# EAGLE schematic schematic (EAGLE 8.4.1)

## Sheet 1 of 2
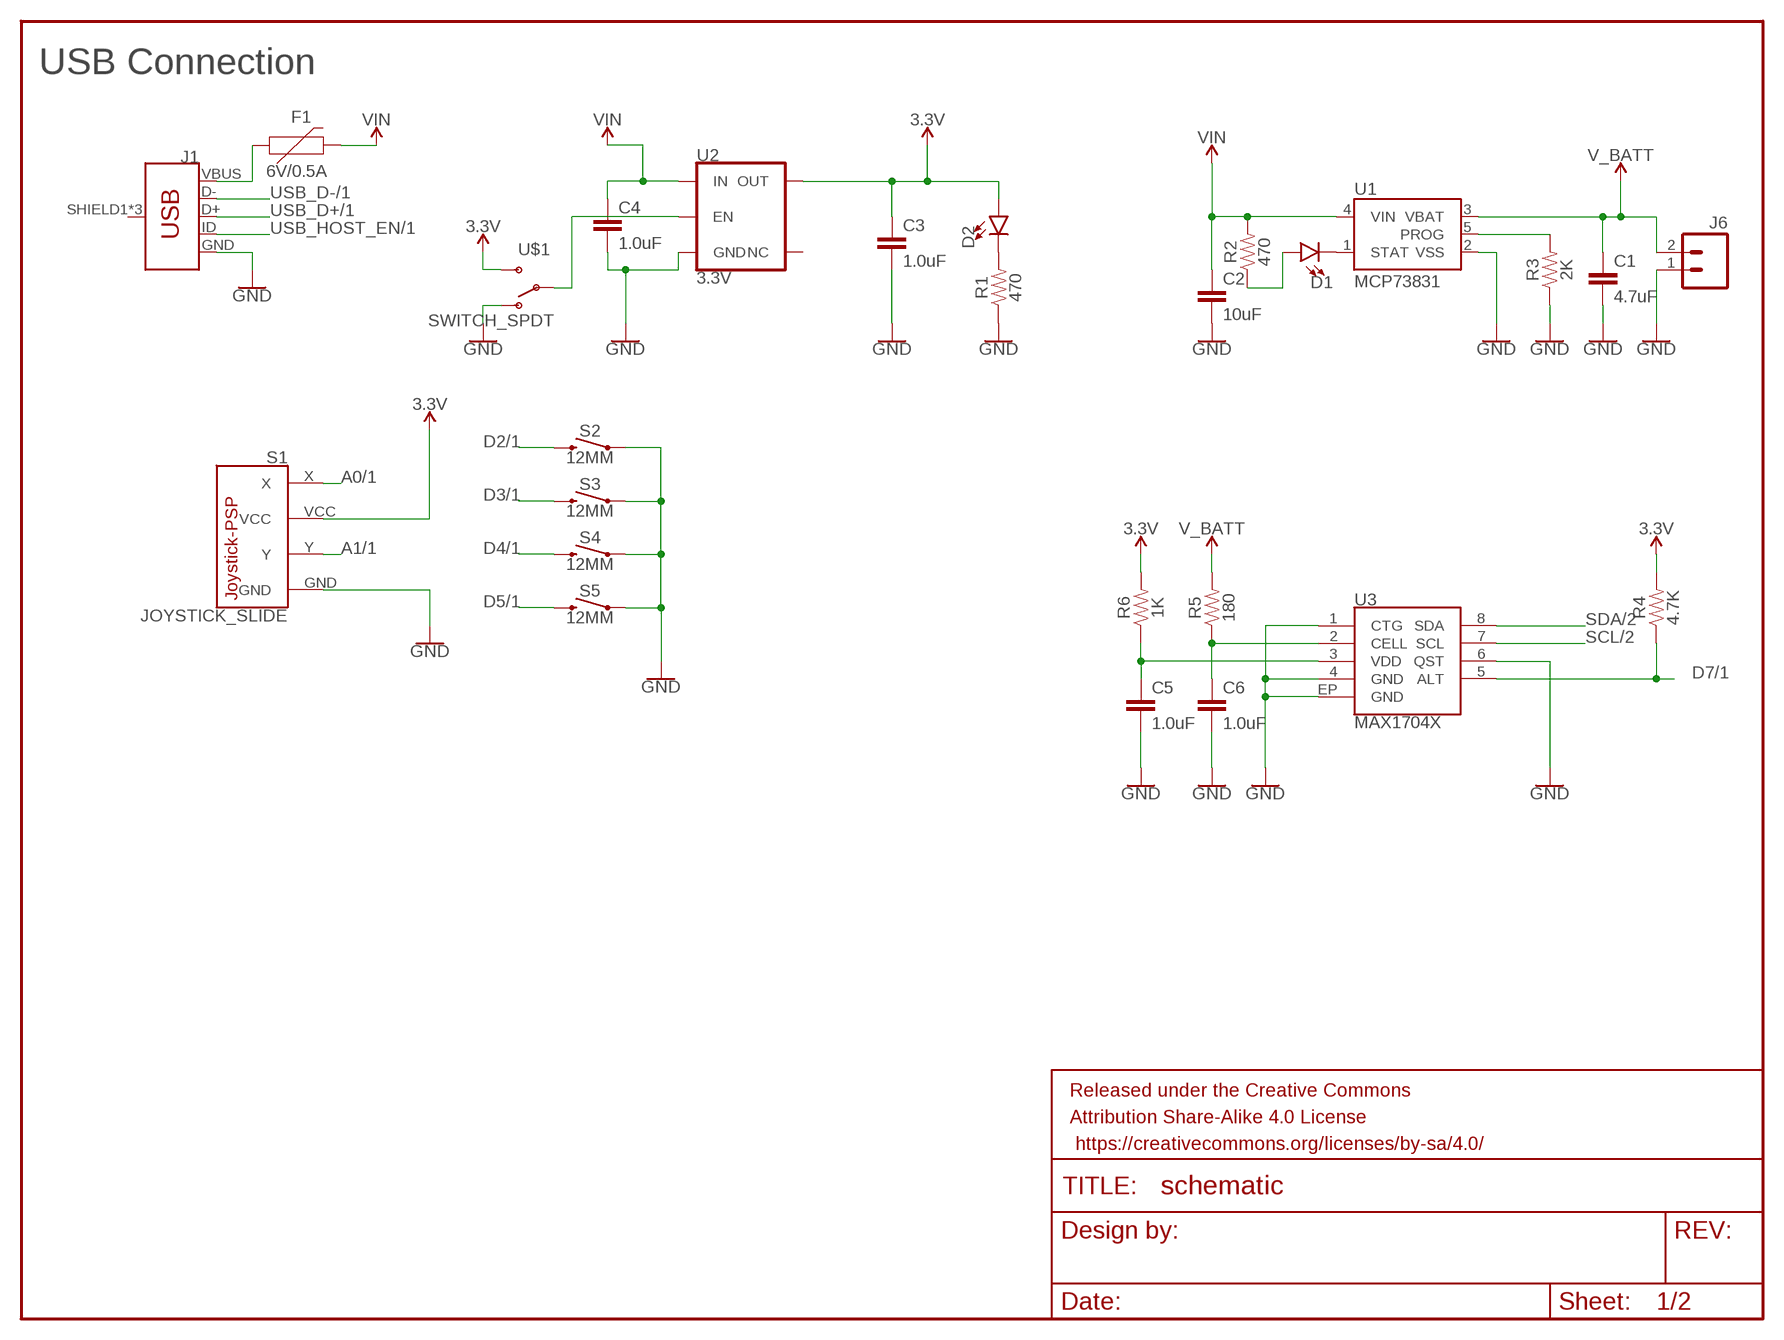
[diagram p0: schematic, sheet 1]

### Parts
C1  4.7uF  10UF-1206-6.3V-20%  [1206]
C2  10uF  10UF-1206-6.3V-20%  [1206]
C3  1.0uF  1.0UF-1206-50V-10%  [1206]
C4  1.0uF  1.0UF-1206-50V-10%  [1206]
C5  1.0uF  1.0UF-1206-50V-10%  [1206]
C6  1.0uF  1.0UF-1206-50V-10%  [1206]
D1  LED-FKIT-1206  [FKIT-LED-1206]
D2  LED-FKIT-1206  [FKIT-LED-1206]
F1  6V/0.5A  PPTC_HALF-AMP  [1206]
FRAME1  FRAME-LETTERNO_PACKAGE  [DUMMY]
J1  USB_MICRO-B_FEMALE-SMT  [USB-B-MICRO-SMD]
J6  M021X02_NO_SILK  [1X02_NO_SILK]
R1  470  0.1OHM-1210-1/2W-1%  [1210]
R2  470  0.1OHM-1210-1/2W-1%  [1210]
R3  2K  0.1OHM-1210-1/2W-1%  [1210]
R4  4.7K  0.1OHM-1210-1/2W-1%  [1210]
R5  180  0.1OHM-1210-1/2W-1%  [1210]
R6  1K  0.1OHM-1210-1/2W-1%  [1210]
S1  JOYSTICK_SLIDE  [JOYSTICK-PSP1000]
S2  12MM  MOMENTARY-SWITCH-SPST-SMD-12MM  [TACTILE_SWITCH_SMD_12MM]
S3  12MM  MOMENTARY-SWITCH-SPST-SMD-12MM  [TACTILE_SWITCH_SMD_12MM]
S4  12MM  MOMENTARY-SWITCH-SPST-SMD-12MM  [TACTILE_SWITCH_SMD_12MM]
S5  12MM  MOMENTARY-SWITCH-SPST-SMD-12MM  [TACTILE_SWITCH_SMD_12MM]
U1  MCP73831  [SOT23-5]
U2  3.3V  V_REG_AP2112K-3.3V  [SOT23-5]
U3  MAX1704X  [TDFN-8]
U$1  SWITCH_SPDT  [KPS-1290]

### Nets
3.3V: C3.1 D2.A R4.2 R6.2 S1.VCC U2.5(OUT) U$1.S ; also sheet 2
A0/1: S1.X ; also sheet 2
A1/1: S1.Y ; also sheet 2
D2/1: S2.3 ; also sheet 2
D3/1: S3.3 ; also sheet 2
D4/1: S4.3 ; also sheet 2
D5/1: S5.3 ; also sheet 2
D7/1: R4.1 U3.5(ALT) ; also sheet 2
GND: C1.2 C2.2 C3.2 C4.2 C5.2 C6.2 J1.GND J6.1 R1.1 R3.1 S1.GND S2.1 S3.1 S4.1 S5.1 U1.2(VSS) U2.2(GND) U3.1(CTG) U3.4(GND) U3.6(QST) U3.EP(GND) U$1.O ; also sheet 2
N$1: C5.1 R6.1 U3.3(VDD)
N$2: C6.1 R5.1 U3.2(CELL)
N$3: D1.A R2.1
N$4: D1.C U1.1(STAT)
N$5: U2.3(EN) U$1.P
N$6: R3.2 U1.5(PROG)
N$7: F1.1 J1.VBUS
N$8: D2.C R1.2
SCL/2: U3.7(SCL)
SDA/2: U3.8(SDA)
USB_D+/1: J1.D+ ; also sheet 2
USB_D-/1: J1.D- ; also sheet 2
USB_HOST_EN/1: J1.ID
V_BATT: C1.1 J6.2 R5.2 U1.3(VBAT)
VIN: C2.1 C4.1 F1.2 R2.2 U1.4(VIN) U2.1(IN)
Unconnected: J1.SHIELD1(SHIELD) J1.SHIELD2(SHIELD) J1.SHIELD3(SHIELD) U2.4(NC)

### Notes on the sheet
- USB Connection

## Sheet 2 of 2
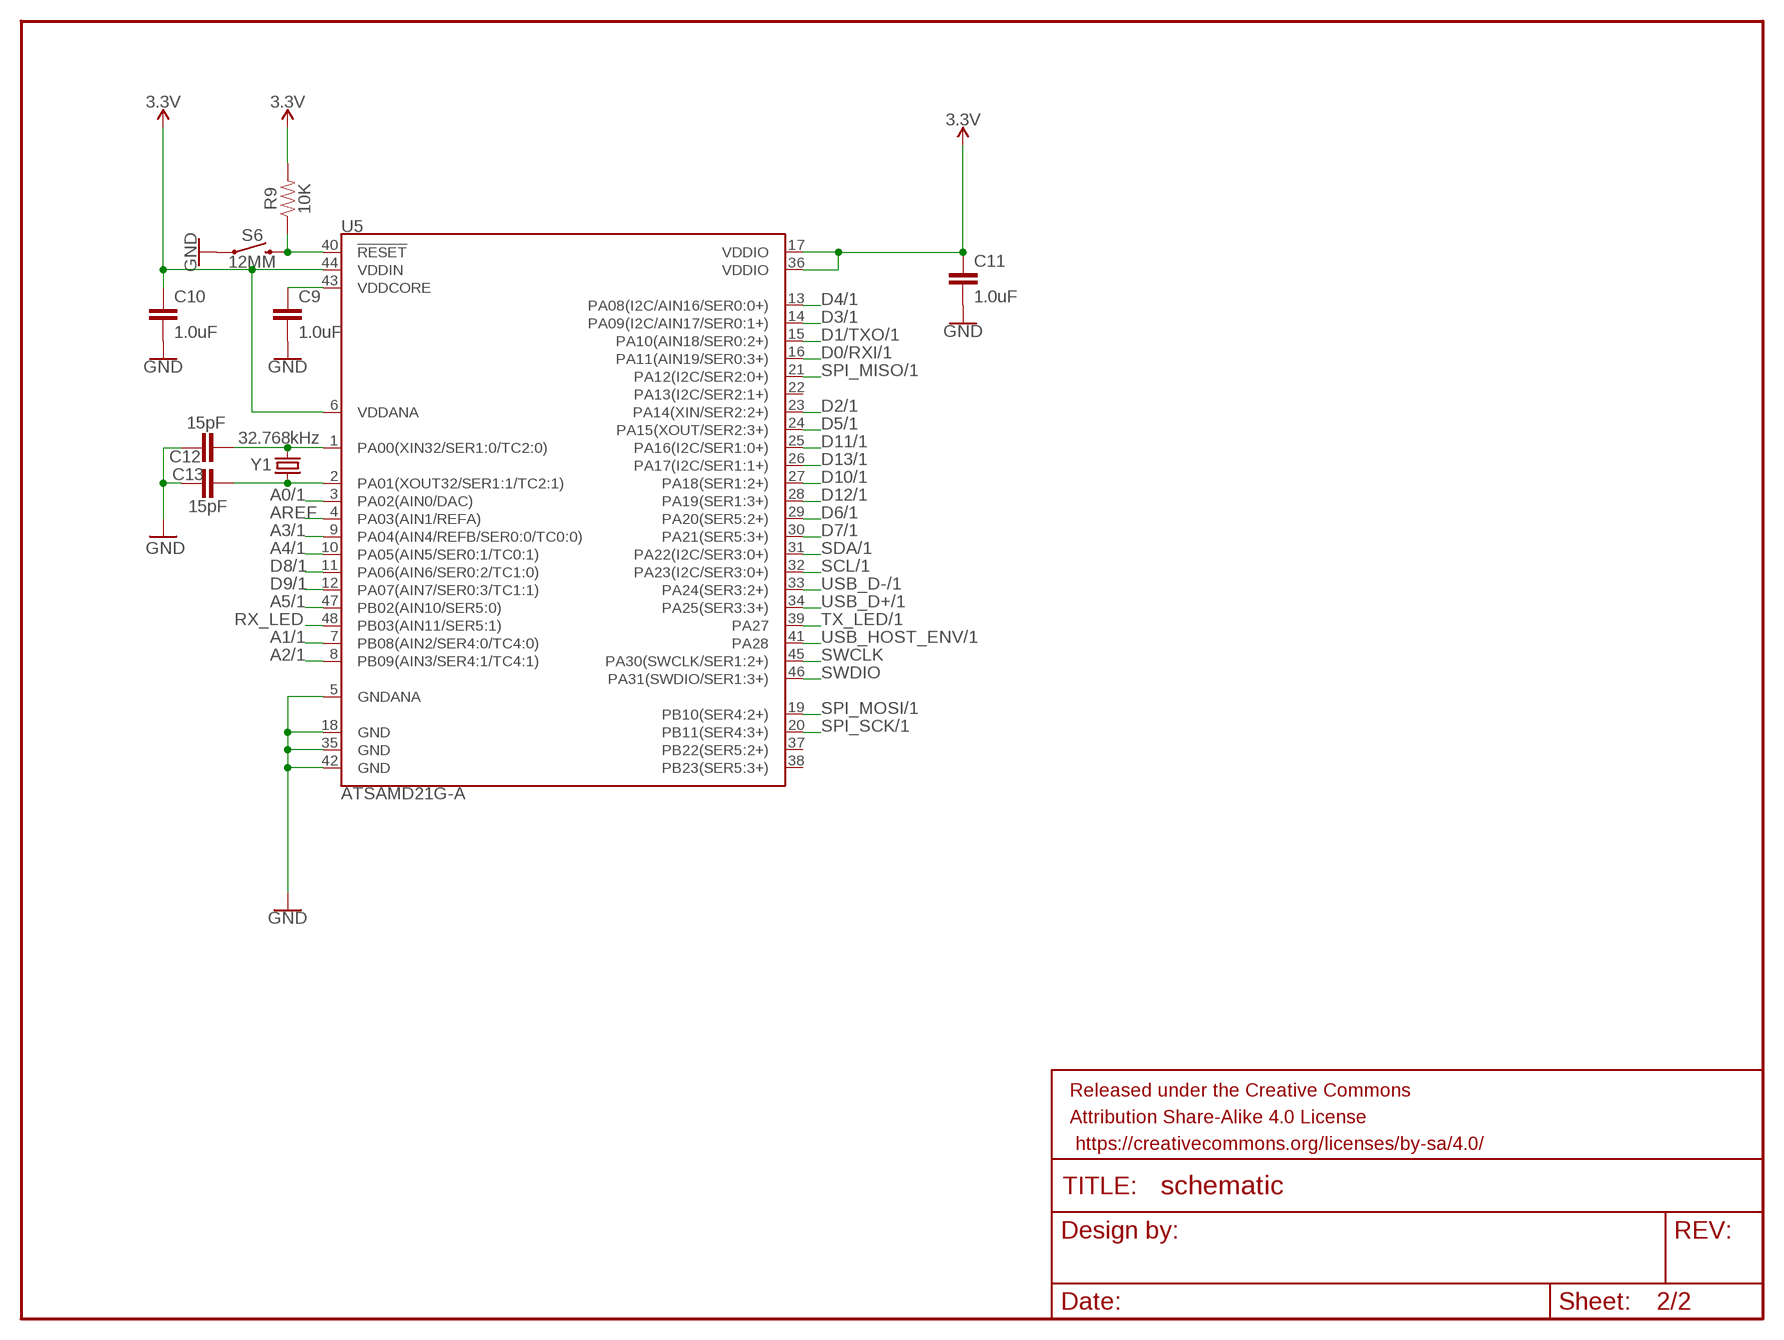
[diagram p1: schematic, sheet 2]

### Parts
C9  1.0uF  1.0UF-1206-50V-10%  [1206]
C10  1.0uF  1.0UF-1206-50V-10%  [1206]
C11  1.0uF  1.0UF-1206-50V-10%  [1206]
C12  15pF  15PF-50V-5%(0603)  [0603-CAP]
C13  15pF  15PF-50V-5%(0603)  [0603-CAP]
FRAME2  FRAME-LETTERNO_PACKAGE  [DUMMY]
R9  10K  0.1OHM-1210-1/2W-1%  [1210]
S6  12MM  MOMENTARY-SWITCH-SPST-SMD-12MM  [TACTILE_SWITCH_SMD_12MM]
U5  ATSAMD21G-A  [TQFP-48]
Y1  32.768kHz  CRYSTAL3.2X1.5MM  [CRYSTAL-SMD-3.2X1.5MM]

### Nets
3.3V: C10.1 C11.1 R9.2 U5.6(VDDANA) U5.17(VDDIO) U5.36(VDDIO) U5.44(VDDIN) ; also sheet 1
A0/1: U5.3(PA02(AIN0/DAC)) ; also sheet 1
A1/1: U5.7(PB08(AIN2/SER4:0/TC4:0)) ; also sheet 1
A2/1: U5.8(PB09(AIN3/SER4:1/TC4:1))
A3/1: U5.9(PA04(AIN4/REFB/SER0:0/TC0:0))
A4/1: U5.10(PA05(AIN5/SER0:1/TC0:1))
A5/1: U5.47(PB02(AIN10/SER5:0))
AREF: U5.4(PA03(AIN1/REFA))
D0/RXI/1: U5.16(PA11(AIN19/SER0:3+))
D1/TXO/1: U5.15(PA10(AIN18/SER0:2+))
D2/1: U5.23(PA14(XIN/SER2:2+)) ; also sheet 1
D3/1: U5.14(PA09(I2C/AIN17/SER0:1+)) ; also sheet 1
D4/1: U5.13(PA08(I2C/AIN16/SER0:0+)) ; also sheet 1
D5/1: U5.24(PA15(XOUT/SER2:3+)) ; also sheet 1
D6/1: U5.29(PA20(SER5:2+))
D7/1: U5.30(PA21(SER5:3+)) ; also sheet 1
D8/1: U5.11(PA06(AIN6/SER0:2/TC1:0))
D9/1: U5.12(PA07(AIN7/SER0:3/TC1:1))
D10/1: U5.27(PA18(SER1:2+))
D11/1: U5.25(PA16(I2C/SER1:0+))
D12/1: U5.28(PA19(SER1:3+))
D13/1: U5.26(PA17(I2C/SER1:1+))
GND: C9.2 C10.2 C11.2 C12.1 C13.1 S6.1 U5.5(GNDANA) U5.18(GND) U5.35(GND) U5.42(GND) ; also sheet 1
N$15: C12.2 U5.1(PA00(XIN32/SER1:0/TC2:0)) Y1.P$2
N$21: C9.1 U5.43(VDDCORE)
N$22: C13.2 U5.2(PA01(XOUT32/SER1:1/TC2:1)) Y1.P$1
RESET: R9.1 S6.3 U5.40(!RESET!)
RX_LED: U5.48(PB03(AIN11/SER5:1))
SCL/1: U5.32(PA23(I2C/SER3:0+))
SDA/1: U5.31(PA22(I2C/SER3:0+))
SPI_MISO/1: U5.21(PA12(I2C/SER2:0+))
SPI_MOSI/1: U5.19(PB10(SER4:2+))
SPI_SCK/1: U5.20(PB11(SER4:3+))
SWCLK: U5.45(PA30(SWCLK/SER1:2+))
SWDIO: U5.46(PA31(SWDIO/SER1:3+))
TX_LED/1: U5.39(PA27)
USB_D+/1: U5.34(PA25(SER3:3+)) ; also sheet 1
USB_D-/1: U5.33(PA24(SER3:2+)) ; also sheet 1
USB_HOST_ENV/1: U5.41(PA28)
Unconnected: U5.22(PA13(I2C/SER2:1+)) U5.37(PB22(SER5:2+)) U5.38(PB23(SER5:3+))

## Library data of the parts
C1 = SparkFun-Capacitors:10UF: 10.0µF ceramic capacitors A capacitor is a passive two-terminal electrical component used to store electrical energy temporarily in an electric field.; PROD_ID: CAP-10057; VALUE: 10uF
C2 = SparkFun-Capacitors:10UF: 10.0µF ceramic capacitors A capacitor is a passive two-terminal electrical component used to store electrical energy temporarily in an electric field.; PROD_ID: CAP-10057
C3-C6 C9-C11 = SparkFun-Capacitors:1.0UF: 1µF ceramic capacitors A capacitor is a passive two-terminal electrical component used to store electrical energy temporarily in an electric field.; PROD_ID: CAP-09822
C12 C13 = SparkFun-Capacitors:15PF-50V-5%(0603): CAP-07881; PROD_ID: CAP-07881
D1 D2 = SparkFun-LED:LED: LED (Generic) Standard schematic elements and footprints for 5mm, 3mm, 1206, and 0603 sized LEDs. Generic LEDs with no color specified.
F1 = SparkFun-Fuses:PPTC: Resettable Fuse PPTC Resettable Fuse. Really a sort of resistor with a polymeric positive temperature coefficient whose resistance increases dramatically with an increase in temperature. When heated by the power passing through the resistance rises causing the current to be limited, protecting the circuit. This is achieved by the transition of the polymer from a crystalline to an amorphous state where the conductive carbon separates breaking the conductive pathways found in the cool crystalline structure. When a PPTC cools back down it resumes conducting letting the circuit turn back on. SparkFun Products: SparkFun RedBoard - Programmed with Arduino <https://www.sparkfun.com/products/12757> Pro Micro - 5V/16MHz <https://www.sparkfun.com/products/12640> Arduino Pro 328 - 5V/16MHz <https://www.sparkfun.com/products/10915> MP3 Trigger <https://www.sparkfun.com/products/13720>; PROD_ID: RES-08585
FRAME1 FRAME2 = SparkFun-Aesthetics:FRAME-LETTER: Schematic Frame - Letter Standard 8.5x11 US Letter frame; DESIGNER: Nobody; VERSION: v01
J1 = SparkFun-Connectors:USB_MICRO-B: USB Type Micro-B Connector Male/female and PTH/SMT variants SparkFun Products: SparkFun microB USB Breakout <https://www.sparkfun.com/products/12035> SparkFun USB microB Plug Breakout <https://www.sparkfun.com/products/10031> SparkFun ESP8266 Thing <https://www.sparkfun.com/products/13231>; PROD_ID: CONN-11752
J6 = SparkFun-Connectors:M02: Standard 2-pin 0.1" header. Use with - straight break away headers ( PRT-00116) - right angle break away headers (PRT-00553) - swiss pins (PRT-00743) - machine pins (PRT-00117) - female headers (PRT-00115) Molex polarized connector foot print use with: PRT-08233 with associated crimp pins and housings. 2.54_SCREWTERM for use with PRT-10571. 3.5mm Screw Terminal footprints for PRT-08084 5mm Screw Terminal footprints for use with PRT-08432
R1-R6 R9 = SparkFun-Resistors:0.1OHM: 0.1Ω resistor A resistor is a passive two-terminal electrical component that implements electrical resistance as a circuit element. Resistors act to reduce current flow, and, at the same time, act to lower voltage levels within circuits. - Wikipedia; PROD_ID: RES-12374; VALUE: 0.1
S1 = SparkFun-Switches:JOYSTICK_SLIDE: Resistive Thumb Slide Joystick This is a resistive analog joystick, very similar to those found on the PSP1000. These compact joysticks are different in that they have a very interesting ‘slide’ feeling. SparkFun Products Thumb Slide Joystick <https://www.sparkfun.com/products/9426> (COM-09426); SF_SKU: COM-09426
S2-S6 = SparkFun-Switches:MOMENTARY-SWITCH-SPST: Momentary Switch (Pushbutton) - SPST Normally-open (NO) SPST momentary switches (buttons, pushbuttons). Variants PTH-12MM - 12mm square, through-hole Momentary Pushbutton Switch - 12mm Square <https://www.sparkfun.com/products/9190> (COM-09190) PTH-6.0MM, PTH-6.0MM-KIT - 6.0mm square, through-hole Mini Pushbutton Switch <https://www.sparkfun.com/products/97> (COM-00097) KIT package intended for soldering kit's - only one side of pads' copper is exposed. PTH-RIGHT-ANGLE-KIT - Right-angle, through-hole Right Angle Tactile Button <https://www.sparkfun.com/products/10791> - Used on SparkFun BigTime Watch Kit <https://www.sparkfun.com/products/11734> SMD-12MM - 12mm square, surface-mount Tactile Button - SMD (12mm) <https://www.sparkfun.com/products/12993> (COM-12993) Used on SparkFun PicoBoard <https://www.sparkfun.com/products/11888> SMD-4.5MM - 4.5mm Square Trackball Switch Used on SparkFun Blackberry Trackballer Breakout <https://www.sparkfun.com/products/13169> SMD-4.6MMX2.8MM - 4.60mm x 2.80mm, surface mount Used on SparkFun SAMD21 Mini Breakout <https://www.sparkfun.com/products/13664> SMD-5.2MM, SMD-5.2-REDUNDANT - 5.2mm square, surface-mount Mini Pushbutton Switch - SMD <https://www.sparkfun.com/products/8720> (COM-08720) Used on Arduino Pro Mini <https://www.sparkfun.com/products/11114> REDUNDANT package connects both switch circuits together SMD-6.0X3.5MM - 6.0 x 3.5mm, surface mount Momentary Reset Switch SMD <https://www.sparkfun.com/products/8229> (COM-08229) SMD-6.2MM-TALL - 6.2mm square, surface mount Tactile Button - SMD (6mm) <https://www.sparkfun.com/products/12992> Used on SparkFun Digital Sandbox <https://www.sparkfun.com/products/12651> SMD-RIGHT-ANGLE - Right-angle, surface mount Used on SparkFun Block for Intel® Edison - Arduino <https://www.sparkfun.com/products/13036>; PROD_ID: SWCH-11967; SF_SKU: COM-12993
U1 = SparkFun-IC-Power:MCP73831: MCP73831T Li-Ion, Li-Pol Controller Miniature single cell, fully integrated Li-Ion, Li-polymer charge management controller Datasheet <http://ww1.microchip.com/downloads/en/DeviceDoc/20001984g.pdf> SparkFun Products: SparkFun ESP32 Thing <https://www.sparkfun.com/products/13907> SparkFun 9DoF Razor IMU M0 <https://www.sparkfun.com/products/14001>; PROD_ID: IC-09995
U2 = SparkFun-IC-Power:V_REG_AP2112: AP2112 - 600mA CMOS LDO Regulator w/ Enable The AP2112 is CMOS process low dropout linear regulator with enable function, the regulator delivers a guaranteed 600mA (min.) continuous load current. Features Output Voltage Accuracy: ±1.5% Output Current: 600mA (Min.) Foldback Short Current Protection: 50mA Enable Function to Turn ON/OFF VOUT Low Dropout Voltage (3.3V): 250mV (Typ.) @IOUT=600mA Excellent Load Regulation: 0.2%/A (Typ.) Excellent Line Regulation: 0.02%/V (Typ.) Low Quiescent Current: 55μA (Typ.) Low Standby Current: 0.01μA (Typ.) Low Output Noise: 50μVRMS PSRR: 100Hz -65dB, 1kHz -65dB OTSD Protection Stable with 1.0μF Flexible Cap: Ceramic, Tantalum and Aluminum Electrolytic Operation Temperature Range: -40°C to 85°C ESD: MM 400V, HBM 4000V; PROD_ID: VREG-12457
U3 = SparkFun-IC-Power:MAX1704X: MAX17043/MAX17044: Battery Fuel Guage (43 is 1cell, 44 is 2cell); PROD-ID: IC-10399
U5 = SparkFun-IC-Microcontroller:ATSAMD21G: Atmel SAMD21G SMART ARM-Based Microcontroller The Atmel ® | SMART ™ SAM D21 is a series of low-power microcontrollers using the 32-bit ARM ® Cortex ® -M0+ processor, and ranging from 32- to 64-pins with up to 256KB Flash and 32KB of SRAM. The SAM D21 devices operate at a maximum frequency of 48MHz and reach 2.46 CoreMark/MHz. They are designed for simple and intuitive migration with identical peripheral modules, hex compatible code, identical linear address map and pin compatible migration paths between all devices in the product series. All devices include intelligent and flexible peripherals, Atmel Event System for inter-peripheral signaling, and support for capacitive touch button, slider and wheel user interfaces. Datasheet <https://cdn.sparkfun.com/datasheets/Dev/Arduino/Boards/Atmel-42181-SAM-D21_Datasheet.pdf> SparkFun Products SparkFun SAMD21 Mini Breakout <https://www.sparkfun.com/products/13664> (DEV-13664) SparkFun SAMD21 Dev Breakout <https://www.sparkfun.com/products/13672> (DEV-13672); PROD_ID: IC-13064
U$1 = SparkFun-Retired:SWITCH_SPDT: SWCH-10651 Side-actuated SPDT slide switch, as used on the Arduino Pro; PROD_ID: SWCH-10651
Y1 = SparkFun-FreqCtrl:CRYSTAL: Various standard crystals. Proven footprints.; PROD_ID: XTAL-13062